# Altium schematic sheet Trottinette_Telemetrie_Circuit.SchDoc
size Tabloid; Date: Date; Author: Author 1; Revision: 1; SheetNumber: 3; SheetTotal: 4; Size: 11x17; Sheet_Name: Circuit
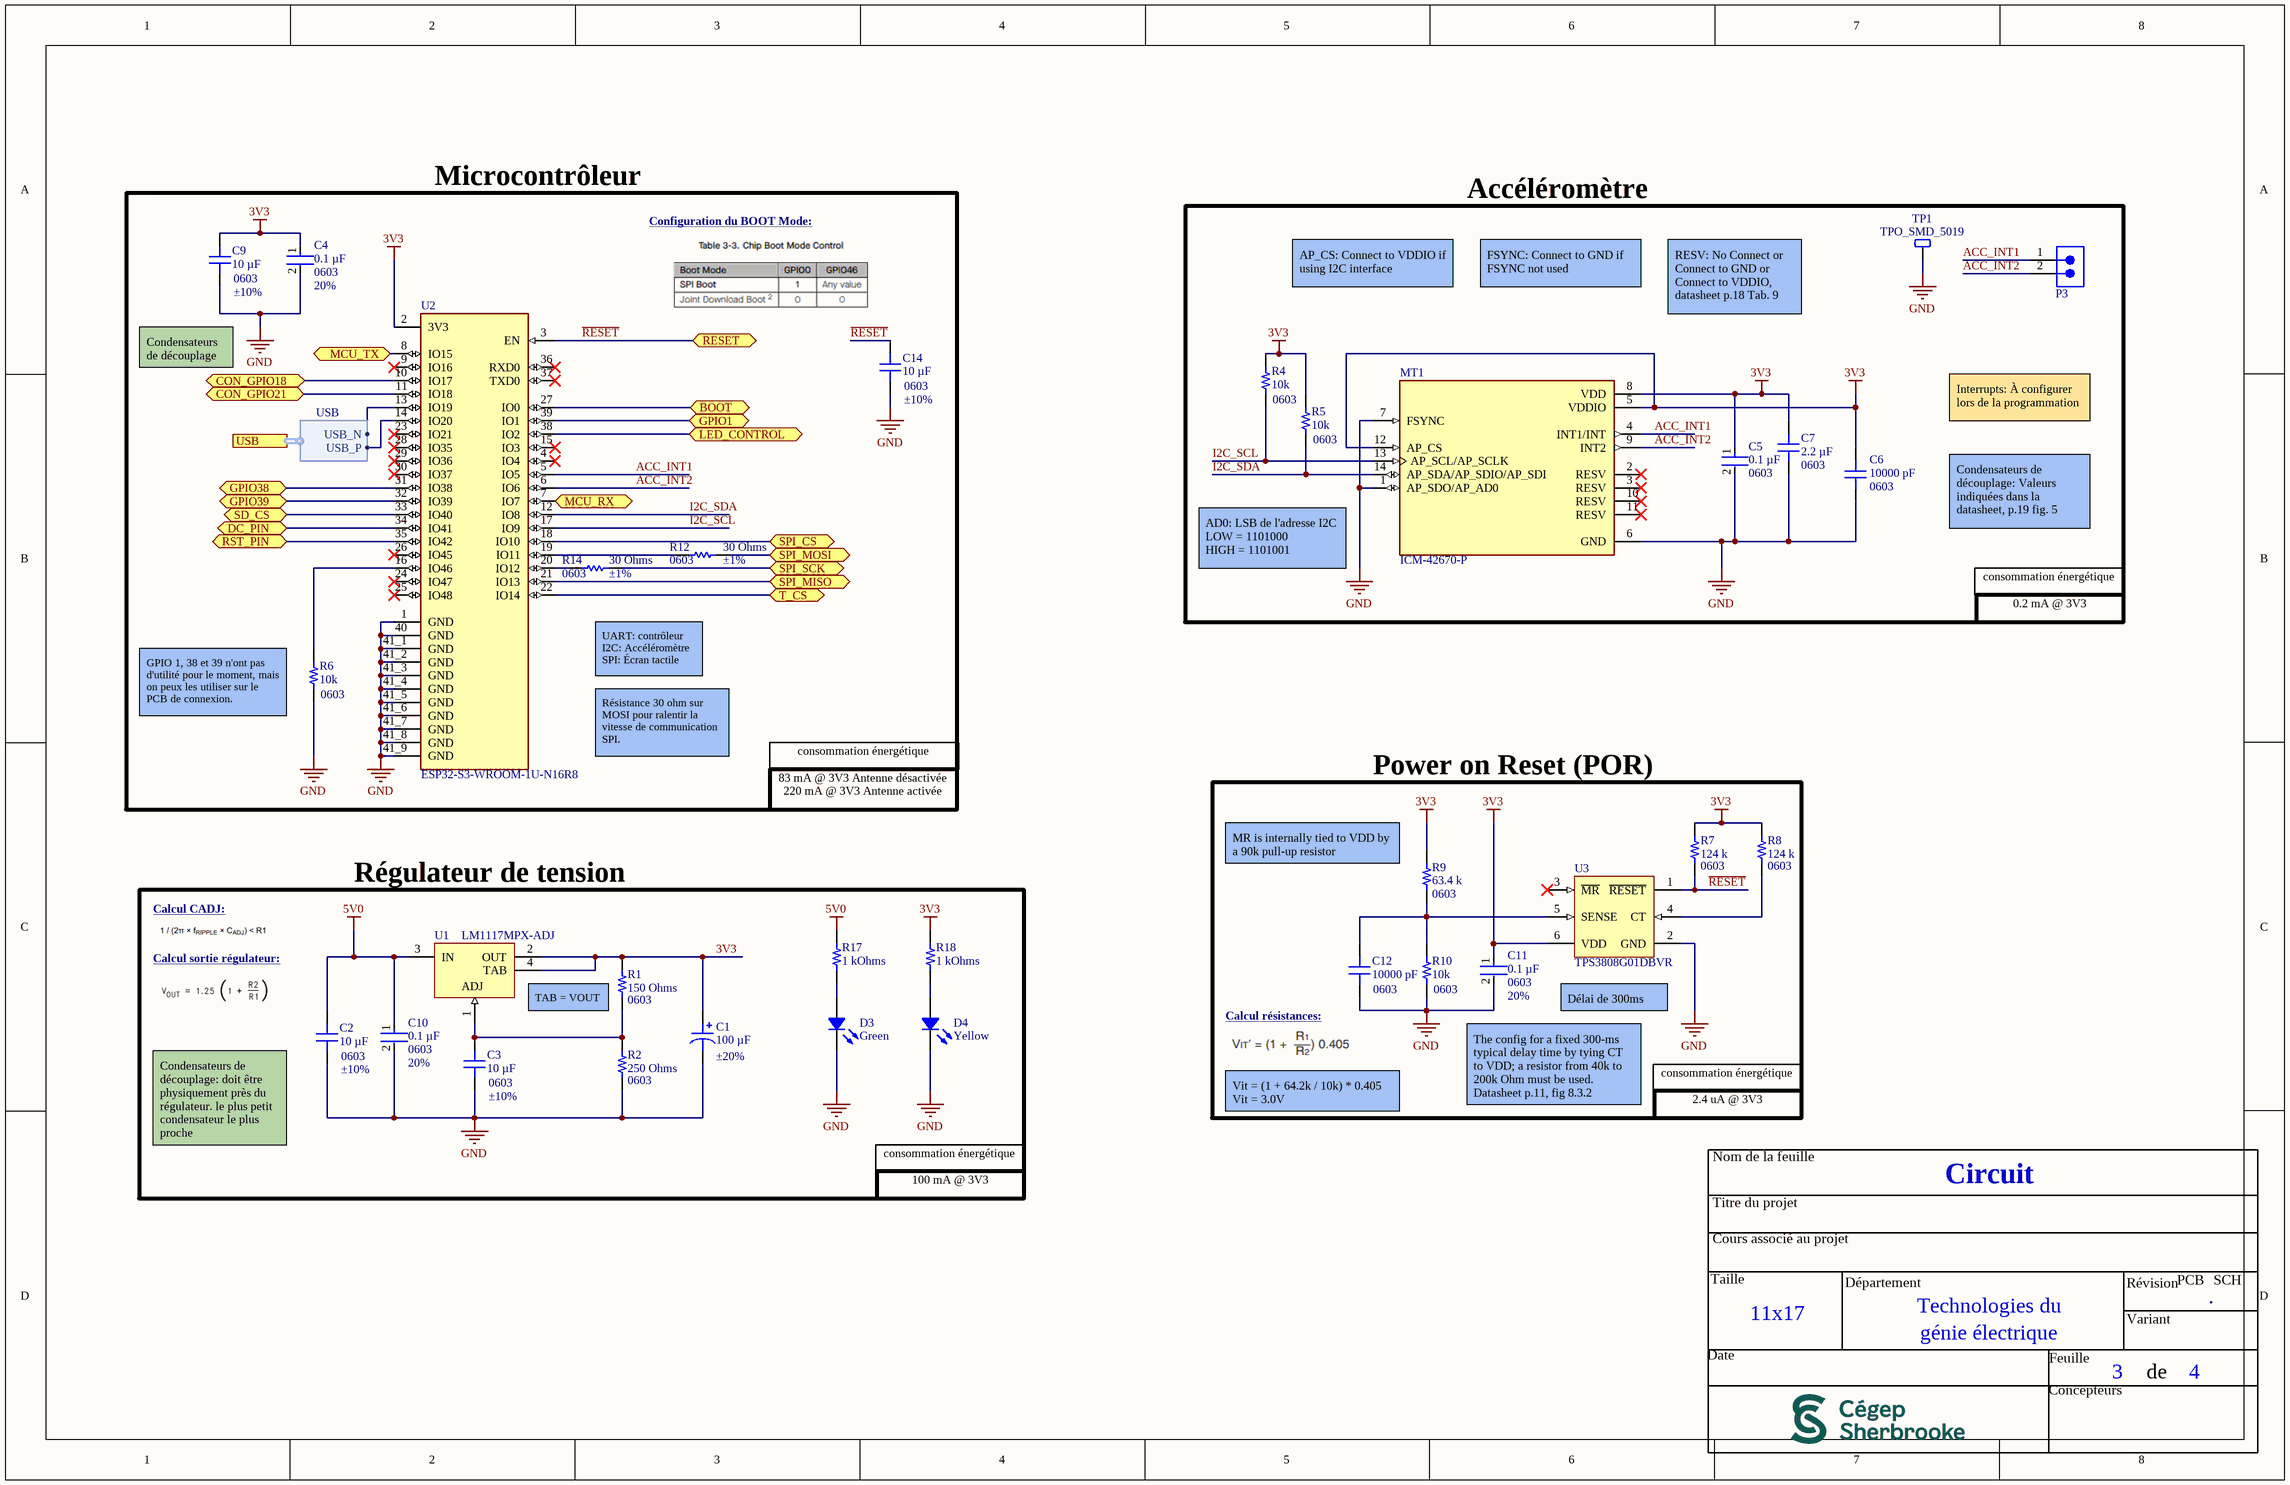
[diagram p0: Trottinette_Telemetrie_Circuit.SchDoc]

## Parts
C1  100 µF  Tolerance: ±20%  [CAP ALSMD 6.6MM H6.1MM]
C2  Device Package: 0603  Tolerance: ±10%  [CAP 0603_1608]  (hidden comment: 10 µF)
C3  Device Package: 0603  Tolerance: ±10%  [CAP 0603_1608]  (hidden comment: 10 µF)
C4  Case Code (Imperial): 0603  Tolerance: 20%  Capacitance: 0.1 µF  [FP-0603-L_1_6_0_15-W_0_81-IPC_B]  (hidden comment: 0603ZC104MAT2A)
C5  Case Code (Imperial): 0603  Capacitance: 0.1 µF  [FP-0603-L_1_6_0_15-W_0_81-IPC_B]  (hidden comment: 0603ZC104MAT2A)
C6  Package / Case: 0603  [CAP 0603_1608]  (hidden comment: 10000 pF)
C7  Package / Case: 0603  [CAP 0603_1608]  (hidden comment: 2.2 µF)
C9  Device Package: 0603  Tolerance: ±10%  [CAP 0603_1608]  (hidden comment: 10 µF)
C10  Case Code (Imperial): 0603  Tolerance: 20%  Capacitance: 0.1 µF  [FP-0603-L_1_6_0_15-W_0_81-IPC_B]  (hidden comment: 0603ZC104MAT2A)
C11  Case Code (Imperial): 0603  Tolerance: 20%  Capacitance: 0.1 µF  [FP-0603-L_1_6_0_15-W_0_81-IPC_B]  (hidden comment: 0603ZC104MAT2A)
C12  Device Package: 0603  [CAP 0603_1608]  (hidden comment: 10000 pF)
C14  Device Package: 0603  Tolerance: ±10%  [CAP 0603_1608]  (hidden comment: 10 µF)
D3  Green  [LED 0603_1608 GREEN]
D4  Yellow  [LED 0603_1608 YELLOW]
MT1  ICM-42670-P  [XDCR_ICM-42670-P]
P3  61300211121  [61300211121]  (value not drawn)
R1  Supplier Device Package: 0603  [RES 0603_1608]  (hidden comment: 150 Ohms)
R2  Supplier Device Package: 0603  [RES 0603_1608]  (hidden comment: 250 Ohms)
R4  Supplier Device Package: 0603  [RES 0603_1608]  (hidden comment: 10k)
R5  Supplier Device Package: 0603  [RES 0603_1608]  (hidden comment: 10k)
R6  Supplier Device Package: 0603  [RES 0603_1608]  (hidden comment: 10k)
R7  Supplier Device Package: 0603  [RES 0603_1608]  (hidden comment: 124 k)
R8  Supplier Device Package: 0603  [RES 0603_1608]  (hidden comment: 124 k)
R9  Supplier Device Package: 0603  [RES 0603_1608]  (hidden comment: 63.4 k)
R10  Supplier Device Package: 0603  [RES 0603_1608]  (hidden comment: 10k)
R12  ERJ3EKF30R0V  [RESC1608X55X30LL15T15]  (value not drawn)
R14  ERJ3EKF30R0V  [RESC1608X55X30LL15T15]  (value not drawn)
R17  1 kOhms  [RES 0603_1608]
R18  1 kOhms  [RES 0603_1608]
TP1  TPO_SMD_5019  [TPO_SMD_5019]
U1  LM1117MPX-ADJ  [MP04A_N]
U2  ESP32-S3-WROOM-1U-N16R8  [XCVR_ESP32-S3-WROOM-1U-N16R8]
U3  TPS3808G01DBVR  [DBV0006A_L]

## Blocks framed on the sheet
Microcontrôleur: C4 C9 C14 R6 R12 R14 U2
Accéléromètre: C5-C7 MT1 P3 R4 R5 TP1
Power on Reset (POR): C11 C12 R7-R10 U3
Régulateur de tension: C1-C3 C10 D3 D4 R1 R2 R17 R18 U1

## Ports
BOOT (bidir), CON_GPIO18 (bidir), CON_GPIO21 (bidir), DC_PIN (bidir), GPIO1 (bidir), GPIO38 (bidir), GPIO39 (bidir), LED_CONTROL (bidir), MCU_RX (bidir), MCU_TX (bidir), RESET (bidir), RST_PIN (bidir), SD_CS (bidir), SPI_CS (bidir), SPI_MISO (bidir), SPI_MOSI (bidir), SPI_SCK (bidir), T_CS (bidir), USB (harness USB)

## Harnesses
USB: USB_N, USB_P

## Nets
3V3: C1.1 C4.1 C5.1 C6.2 C7.2 C9.2 C11.1 MT1.5(VDDIO) MT1.8(VDD) MT1.12(AP_CS) R1.2 R4.2 R5.2 R7.2 R8.2 R9.2 R18.1 U1.2(OUT) U1.4(TAB) U2.2(3V3) U3.6(VDD)
5V0: C2.2 C10.1 R17.1 U1.3(IN)
GND: C1.2 C2.1 C3.1 C4.2 C5.2 C6.1 C7.1 C9.1 C10.2 C11.2 C12.1 C14.1 D3.2 D4.2 MT1.1(AP_SDO/AP_AD0) MT1.6(GND) MT1.7(FSYNC) R2.1 R6.1 R10.1 TP1.1 U2.1(GND) U2.40(GND) U2.41_1(GND) U2.41_2(GND) U2.41_3(GND) U2.41_4(GND) U2.41_5(GND) U2.41_6(GND) U2.41_7(GND) U2.41_8(GND) U2.41_9(GND) U3.2(GND)
~{RESET}: C14.2 R7.1 U2.3(EN) U3.1(~{RESET}) ; port RESET
ACC_INT1: MT1.4(INT1/INT) P3.1 U2.5(IO5)
ACC_INT2: MT1.9(INT2) P3.2 U2.6(IO6)
BOOT: U2.27(IO0) ; port BOOT
CON_GPIO18: U2.10(IO17) ; port CON_GPIO18
CON_GPIO21: U2.11(IO18) ; port CON_GPIO21
DC_PIN: U2.34(IO41) ; port DC_PIN
GPIO1: U2.39(IO1) ; port GPIO1
GPIO38: U2.31(IO38) ; port GPIO38
GPIO39: U2.32(IO39) ; port GPIO39
I2C_SCL: MT1.13(AP_SCL/AP_SCLK) R4.1 U2.17(IO9)
I2C_SDA: MT1.14(AP_SDA/AP_SDIO/AP_SDI) R5.1 U2.12(IO8)
LED_CONTROL: U2.38(IO2) ; port LED_CONTROL
MCU_RX: U2.7(IO7) ; port MCU_RX
MCU_TX: U2.8(IO15) ; port MCU_TX
RST_PIN: U2.35(IO42) ; port RST_PIN
SD_CS: U2.33(IO40) ; port SD_CS
SPI_CS: U2.18(IO10) ; port SPI_CS
SPI_MISO: U2.21(IO13) ; port SPI_MISO
SPI_MOSI: R12.2 ; port SPI_MOSI
SPI_SCK: R14.2 ; port SPI_SCK
T_CS: U2.22(IO14) ; port T_CS
NetC3_2: C3.2 R1.1 R2.2 U1.1(ADJ)
NetC12_2: C12.2 R9.1 R10.2 U3.5(SENSE)
NetD3_1: D3.1 R17.2
NetD4_1: D4.1 R18.2
NetR6_2: R6.2 U2.16(IO46)
NetR8_1: R8.1 U3.4(CT)
NetR12_1: R12.1 U2.19(IO11)
NetR14_1: R14.1 U2.20(IO12)
NetU2_13: U2.13(IO19) ; port USB.USB_N
NetU2_14: U2.14(IO20) ; port USB.USB_P

Not connected (* = marked no-connect by the designer): MT1 2(RESV)* 3(RESV)* 10(RESV)* 11(RESV)*; U2 4(IO4)* 9(IO16)* 15(IO3)* 23(IO21)* 24(IO47)* 25(IO48)* 26(IO45)* 28(IO35)* 29(IO36)* 30(IO37)* 36(RXD0)* 37(TXD0)*; U3 3(~{MR})*

## Notes on the sheet
- Configuration du BOOT Mode:
- AP_CS: Connect to VDDIO if using I2C interface
- FSYNC: Connect to GND if FSYNC not used
- Condensateurs de découplage
- RESV: No Connect or Connect to GND or Connect to VDDIO, datasheet p.18 Tab. 9
- Interrupts: À configurer lors de la programmation
- (near R14) 30 Ohms
- (near R12) 0603
- (near R12) 30 Ohms
- (near R12) ±1%
- AD0: LSB de l'adresse I2C LOW = 1101000
  HIGH = 1101001
- Condensateurs de découplage: Valeurs indiquées dans la datasheet, p.19 fig. 5
- (near R14) 0603
- (near R14) ±1%
- consommation énergétique
- 0.2 mA @ 3V3
- UART: contrôleur I2C: Accéléromètre SPI: Écran tactile
- (near R6) GPIO 1, 38 et 39 n'ont pas d'utilité pour le moment, mais on peux les utiliser sur le PCB de connexion.
- Résistance 30 ohm sur MOSI pour ralentir la vitesse de communication SPI.
- 83 mA @ 3V3 Antenne désactivée 220 mA @ 3V3 Antenne activée
- (near R9) MR is internally tied to VDD by a 90k pull-up resistor
- Calcul sortie régulateur:
- Calcul CADJ:
- TAB = VOUT
- (near C12) Calcul résistances:
- (near U3) Délai de 300ms
- Vit = (1 + 64.2k / 10k) * 0.405 Vit = 3.0V
- The config for a fixed 300-ms typical delay time by tying CT to VDD; a resistor from 40k to 200k Ohm must be used. Datasheet p.11, fig 8.3.2
- (near C2) Condensateurs de découplage: doit être physiquement près du régulateur. le plus petit condensateur le plus proche
- 2.4 uA @ 3V3
- 100 mA @ 3V3
- Nom de la feuille
- Titre du projet
- Cours associé au projet
- Taille
- Département
- Technologies du
- Révision
- PCB
- .
- SCH
- Date
- génie électrique
- Feuille
- Variant
- de
- Concepteurs

## Library data of the parts
C1 = 10SGV100M6.3X6.1: CAP ALUM 100UF 20% 10V SMD; manufacturer: Rubycon; Lifetime @ Temp.: 2000 Hrs @ 105°C; Polarization: Polar; Ripple Current @ High Frequency: 85.2 mA @ 10 kHz; Ripple Current @ Low Frequency: 71 mA @ 120 Hz; Surface Mount Land Size: 0.260" L x 0.260" W (6.60mm x 6.60mm); Part Number: 10SGV100M6.3X6.1; Applications: Automotive; Capacitance: 100 µF; componentlink1description: Datasheet; componentlink1url: http://www.rubycon.co.jp/en/catalog/e_pdfs/aluminum/e_sgv.pdf; componentlink2description: DigiKey Link; componentlink2url: https://www.digikey.com/en/products/detail/rubycon/10SGV100M6-3X6-1/3568604; Device Package: Radial, Can - SMD; Height - Seated (Max): 0.240" (6.10mm); lastupdated: 6/3/2024 8:16:10 PM; Lifecycle Status: Active; Minimum Order: 1; Mounting Type: Surface Mount; Operating Temperature: -55°C ~ 105°C; Package / Case: Radial, Can - SMD; packaging: TapeAndReel; partid: 8082; Part Status: Active; price: 0.08; Ratings: AEC-Q200; series: SGV; Size / Dimension: 0.248" Dia (6.30mm); Supplier 1: DigiKey; Supplier Part Number 1: 1189-2392-1-ND; value: 100 µF; Voltage - Rated: 10 V
C2 C3 C9 C14 = GRT188R61A106KE13D: CAP CER 10UF 10V X5R 0603; manufacturer: Murata Electronics; Part Number: GRT188R61A106KE13D; Value: 10 µF; Applications: Automotive; Capacitance: 10 µF; componentlink1description: Datasheet; componentlink1url: https://search.murata.co.jp/Ceramy/image/img/A01X/G101/ENG/GRT188R61A106KE13-01.pdf; componentlink2description: DigiKey Link; componentlink2url: https://www.digikey.com/en/products/detail/murata-electronics/GRT188R61A106KE13D/5416733; Features: Derating Recommended; lastupdated: 2/9/2024 8:10:30 PM; Lifecycle Status: Active; Minimum Order: 1; Mounting Type: Surface Mount, MLCC; Operating Temperature: -55°C ~ 85°C; Package / Case: 0603 (1608 Metric); packaging: TapeAndReel; partid: 2522; Part Status: Active; price: 0.06; Ratings: AEC-Q200; series: GRT; Size / Dimension: 0.063" L x 0.031" W (1.60mm x 0.80mm); Supplier 1: DigiKey; Supplier Part Number 1: 490-12311-1-ND; Temperature Coefficient: X5R; Thickness (Max): 0.037" (0.95mm); Voltage - Rated: 10V
C4 C5 C10 C11 = CMP-2006-04550-2: General Purpose Ceramic Capacitor, 0603, 100nF, 20%, X7R, 15%, 10V; Mount: Surface Mount; Package Quantity: 4000; RoHS Compliant: Yes; Voltage Rating: 10V; Packaging: Tape and Reel; Series: -; Thickness: 0.035inch; Number of Pins: 2; Min Operating Temperature: -55°C; Case/Package: 0603; Length: 1.6mm; Radiation Hardening: No; Voltage Rating (DC): 10V; Depth: 0.81mm; Lead Pitch: 0.014inch; Termination: SMD/SMT; Case Code (Metric): 1608; Construction: Flat; Width: 0.032inch; Lead Free: Lead Free; Max Operating Temperature: 125°C; Dielectric: X7R
  C5: Tolerance: 20%
C6 = C0603C103K4RECAUTO: CAP CER 0603 10NF 16V X7R 10%; manufacturer: KEMET; Part Number: C0603C103K4RECAUTO; Value: 10000 pF; Applications: Automotive, ESD Protection; Capacitance: 10000 pF; componentlink1description: Datasheet; componentlink1url: https://api.kemet.com/component-edge/download/datasheet/C0603C103K4RECAUTO.pdf; componentlink2description: DigiKey Link; componentlink2url: https://www.digikey.com/en/products/detail/kemet/C0603C103K4RECAUTO/8640474; Device Package: 0603 (1608 Metric); lastupdated: 2/9/2024 8:10:22 PM; Lifecycle Status: Active; Minimum Order: 1; Mounting Type: Surface Mount, MLCC; Operating Temperature: -55°C ~ 125°C; packaging: TapeAndReel; partid: 8251; Part Status: Active; price: 0.01; Ratings: AEC-Q200; series: ESD SMD Auto X7R; Size / Dimension: 0.063" L x 0.031" W (1.60mm x 0.80mm); Supplier 1: DigiKey; Supplier Part Number 1: 399-17880-1-ND; Temperature Coefficient: X7R; Thickness (Max): 0.034" (0.87mm); Tolerance: ±10%; Voltage - Rated: 16V
C7 = CC0603ZRY5V7BB225: CAP CER 2.2UF 16V Y5V 0603; manufacturer: Yageo; Temperature Coefficient: Y5V (F); Tolerance: -20%, +80%; Part Number: CC0603ZRY5V7BB225; Value: 2.2 µF; Applications: General Purpose; Capacitance: 2.2 µF; componentlink1description: Datasheet; componentlink1url: http://www.yageo.com/documents/recent/UPY-GPHC_Y5V_6.3V-to-50V_8.pdf; componentlink2description: DigiKey Link; componentlink2url: https://www.digikey.com/en/products/detail/yageo/CC0603ZRY5V7BB225/5883851; Device Package: 0603 (1608 Metric); lastupdated: 2/9/2024 8:10:30 PM; Lifecycle Status: Active; Minimum Order: 1; Mounting Type: Surface Mount, MLCC; Operating Temperature: -30°C ~ 85°C; packaging: TapeAndReel; partid: 2203; Part Status: Active; price: 0.01; series: CC; Size / Dimension: 0.063" L x 0.031" W (1.60mm x 0.80mm); Supplier 1: DigiKey; Supplier Part Number 1: 311-3416-1-ND; Thickness (Max): 0.035" (0.90mm); Voltage - Rated: 16V
C12 = AC0603KRX7R0BB103: CAP CER 10000PF 100V X7R 0603; manufacturer: Yageo; Tolerance: ±10%; Part Number: AC0603KRX7R0BB103; Value: 10000 pF; Applications: Automotive; Capacitance: 10000 pF; componentlink1description: Datasheet; componentlink1url: http://www.yageo.com/NewPortal/_en/search/productDocs.jsp?YageoPartNumber=AC0603KRX7R0BB103; componentlink2description: DigiKey Link; componentlink2url: https://www.digikey.com/en/products/detail/yageo/AC0603KRX7R0BB103/6643086; lastupdated: 2024-02-09 20:10:30; Lifecycle Status: Active; Minimum Order: 1; Mounting Type: Surface Mount, MLCC; Operating Temperature: -55°C ~ 125°C; Package / Case: 0603 (1608 Metric); packaging: TapeAndReel; partid: 2218; Part Status: Active; price: 0.01; Ratings: AEC-Q200; series: AC; Size / Dimension: 0.063" L x 0.031" W (1.60mm x 0.80mm); Supplier 1: DigiKey; Supplier Part Number 1: 311-3100-1-ND; Temperature Coefficient: X7R; Thickness (Max): 0.035" (0.90mm); Voltage - Rated: 100V
D3 = 5973316507F: LED GREEN 0603 SMD; Manufacturer: Dialight; Configuration: Standard; Current - Test: 20mA; Lens Color: 1.24mm; Lens Style: Round with Domed Top; Millicandela Rating: 34mcd; Voltage - Forward (Vf) (Typ): 2V; Wavelength - Dominant: 560nm; Part Number: 5973316507F; Color: Green; ComponentLink1Description: Datasheet; ComponentLink1URL: http://www.dialightsignalsandcomponents.com/Assets/Drawings/2D_Drawings_DrawingDetailedSpec/NewDrawings/C18371C.pdf; ComponentLink2Description: DigiKey Link; ComponentLink2URL: https://www.digikey.com/en/products/detail/dialight/5973316507F/9385428; Device Package: 0603 (1608 Metric); Height (Max): 1.24mm; LastUpdated: 6/3/2024 7:58:53 PM; Lifecycle Status: Active; Minimum Order: 1; Mounting Type: Surface Mount; Package / Case: 0603 (1608 Metric); Packaging: TapeAndReel; PartId: 587; Part Status: Active; Price: 0.13; Series: 597; Size / Dimension: 1.60mm L x 0.80mm W; Supplier 1: DigiKey; Supplier Part Number 1: 350-4373-1-ND; Supplier Device Package: 0603; Value: Green
D4 = 5990040007F: LED YELLOW 0603 SMD; Manufacturer: Dialight; Configuration: Standard; Current - Test: 20mA; Lens Color: 0.80mm; Lens Size: 1.10mm x 0.80mm; Lens Style: Rectangle with Flat Top; Millicandela Rating: 105mcd; Viewing Angle: 140°; Voltage - Forward (Vf) (Typ): 2.1V; Wavelength - Dominant: 590nm; Part Number: 5990040007F; Color: Yellow; ComponentLink1Description: Datasheet; ComponentLink1URL: http://www.dialightsignalsandcomponents.com/Assets/Brochures_And_Catalogs/Indication/CBI_SMD_new/Dialight_CBI_data_599-0603_Apr2018.pdf; ComponentLink2Description: DigiKey Link; ComponentLink2URL: https://www.digikey.com/en/products/detail/dialight/5990040007F/9385404; Device Package: 0603 (1608 Metric); Height (Max): 0.80mm; LastUpdated: 6/3/2024 8:01:10 PM; Lifecycle Status: Active; Minimum Order: 1; Mounting Type: Surface Mount; Package / Case: 0603 (1608 Metric); Packaging: TapeAndReel; PartId: 83; Part Status: Active; Price: 0.04; Series: 599; Size / Dimension: 1.60mm L x 0.80mm W; Supplier 1: DigiKey; Supplier Part Number 1: 350-4349-1-ND; Supplier Device Package: 0603; Value: Yellow
P3 = 61300211121: WR-PHD Pin Header, THT, Vertical, pitch 2.54mm, 1 Row, 2P; Manufacturer: Wurth Elektronik; Contact Resistance: 20mOhm; Rated Current: 3A; Working Voltage: 250V; Withstanding Voltage: 500V; Manufacturer Part Number: 61300211121; Category: Board-to-Board Connectors; Match Code: WR-PHD; ComponentLink1Description: Website Link; ComponentLink1URL: https://www.we-online.com/redexpert/article/61300211121?ad; ComponentLink2Description: Datasheet Link; ComponentLink2URL: https://www.we-online.com/redexpert/spec/61300211121?ad; Mount: Through Hole; Operating Temperature Max: 105°C; Operating Temperature Min: -40°C; Packaging: Bag; Gender: Pin Header; Number of Pins: 2; Number of Rows: 1; Orientation: Vertical; Pitch: 2.54mm
R1 = RMCF0603FT150R: RES 150 OHM 1% 1/10W 0603; Manufacturer: Stackpole Electronics Inc; Power (Watts): 0.1W, 1/10W; Temperature Coefficient: ±100ppm/°C; Part Number: RMCF0603FT150R; Value: 150 Ohms; ComponentLink1Description: Datasheet; ComponentLink1URL: https://www.seielect.com/catalog/sei-rmcf_rmcp.pdf; ComponentLink2Description: DigiKey Link; ComponentLink2URL: https://www.digikey.com/en/products/detail/stackpole-electronics-inc/RMCF0603FT150R/1761314; Composition: Thick Film; Device Package: 0603 (1608 Metric); Features: Automotive AEC-Q200; Height - Seated (Max): 0.022" (0.55mm); LastUpdated: 2/9/2024 8:43:14 PM; Lifecycle Status: Active; Minimum Order: 1; Number of Terminations: 2; Operating Temperature: -55°C ~ 155°C; Package / Case: 0603 (1608 Metric); Packaging: CutTape; PartId: 10675; Part Status: Active; Price: 0.01; Ratings: AEC-Q200; Resistance: 150 Ohms; Series: RMCF; Size / Dimension: 0.061" L x 0.031" W (1.55mm x 0.80mm); Supplier 1: DigiKey; Supplier Part Number 1: RMCF0603FT150RCT-ND; Tolerance: ±1%
R2 = CH0603-250RJNTA: RES 250 OHM 5% 1/8W 0603; Manufacturer: Vishay Sfernice; Power (Watts): 0.125W, 1/8W; Temperature Coefficient: ±100ppm/°C; Part Number: CH0603-250RJNTA; Value: 250 Ohms; ComponentLink1Description: Datasheet; ComponentLink1URL: http://www.vishay.com/docs/53014/ch.pdf; ComponentLink2Description: DigiKey Link; ComponentLink2URL: https://www.digikey.com/en/products/detail/vishay-sfernice/CH0603-250RJNTA/9405751; Composition: Thin Film; Device Package: 0603 (1608 Metric); Features: RF, High Frequency; Height - Seated (Max): 0.025" (0.63mm); LastUpdated: 2/9/2024 8:43:16 PM; Lifecycle Status: Active; Minimum Order: 1; Number of Terminations: 2; Operating Temperature: -55°C ~ 155°C; Package / Case: 0603 (1608 Metric); Packaging: TapeAndReel; PartId: 10119; Part Status: Active; Price: 2.39; Resistance: 250 Ohms; Series: CH; Size / Dimension: 0.060" L x 0.030" W (1.52mm x 0.76mm); Supplier 1: DigiKey; Supplier Part Number 1: 716-1168-1-ND; Tolerance: ±5%
R4-R6 R10 = RNCS0603BKE10K0: RES 10K OHM 0.1% 1/16W 0603; Manufacturer: Stackpole Electronics Inc; Power (Watts): 0.063W, 1/16W; Resistance: 10 kOhms; Temperature Coefficient: ±25ppm/°C; Part Number: RNCS0603BKE10K0; Value: 10k; ComponentLink1Description: Datasheet; ComponentLink1URL: https://www.seielect.com/catalog/sei-rncs_rnch.pdf; ComponentLink2Description: DigiKey Link; ComponentLink2URL: https://www.digikey.com/en/products/detail/stackpole-electronics-inc/RNCS0603BKE10K0/1708836; Composition: Thin Film; Device Package: 0603 (1608 Metric); Features: Anti-Corrosive, Automotive AEC-Q200, Moisture Resistant; Height - Seated (Max): 0.022" (0.55mm); LastUpdated: 2/9/2024 8:43:37 PM; Lifecycle Status: Active; Minimum Order: 1; Number of Terminations: 2; Operating Temperature: -55°C ~ 155°C; Package / Case: 0603 (1608 Metric); Packaging: TapeAndReel; PartId: 4838; Part Status: Active; Price: 0.06; Ratings: AEC-Q200; Series: RNCS; Size / Dimension: 0.061" L x 0.031" W (1.55mm x 0.80mm); Supplier 1: DigiKey; Supplier Part Number 1: RNCS0603BKE10K0CT-ND; Tolerance: ±0.1%
R7 R8 = RMCF0603FT124K: RES 124K OHM 1% 1/10W 0603; Manufacturer: Stackpole Electronics Inc; Power (Watts): 0.1W, 1/10W; Resistance: 124 kOhms; Temperature Coefficient: ±100ppm/°C; Part Number: RMCF0603FT124K; Value: 124 k; ComponentLink1Description: Datasheet; ComponentLink1URL: https://www.seielect.com/catalog/sei-rmcf_rmcp.pdf; ComponentLink2Description: DigiKey Link; ComponentLink2URL: https://www.digikey.com/en/products/detail/stackpole-electronics-inc/RMCF0603FT124K/1761224; Composition: Thick Film; Device Package: 0603 (1608 Metric); Features: Automotive AEC-Q200; Height - Seated (Max): 0.022" (0.55mm); LastUpdated: 2/9/2024 8:43:13 PM; Lifecycle Status: Active; Minimum Order: 1; Number of Terminations: 2; Operating Temperature: -55°C ~ 155°C; Package / Case: 0603 (1608 Metric); Packaging: CutTape; PartId: 10853; Part Status: Active; Price: 0.01; Ratings: AEC-Q200; Series: RMCF; Size / Dimension: 0.061" L x 0.031" W (1.55mm x 0.80mm); Supplier 1: DigiKey; Supplier Part Number 1: RMCF0603FT124KCT-ND; Tolerance: ±1%
R9 = RMCF0603FT63K4: RES 63.4K OHM 1% 1/10W 0603; Manufacturer: Stackpole Electronics Inc; Power (Watts): 0.1W, 1/10W; Resistance: 63.4 kOhms; Temperature Coefficient: ±100ppm/°C; Part Number: RMCF0603FT63K4; Value: 63.4 k; ComponentLink1Description: Datasheet; ComponentLink1URL: https://www.seielect.com/catalog/sei-rmcf_rmcp.pdf; ComponentLink2Description: DigiKey Link; ComponentLink2URL: https://www.digikey.com/en/products/detail/stackpole-electronics-inc/RMCF0603FT63K4/1714177; Composition: Thick Film; Device Package: 0603 (1608 Metric); Features: Automotive AEC-Q200; Height - Seated (Max): 0.022" (0.55mm); LastUpdated: 2/9/2024 8:43:20 PM; Lifecycle Status: Active; Minimum Order: 1; Number of Terminations: 2; Operating Temperature: -55°C ~ 155°C; Package / Case: 0603 (1608 Metric); Packaging: CutTape; PartId: 8895; Part Status: Active; Price: 0.01; Ratings: AEC-Q200; Series: RMCF; Size / Dimension: 0.061" L x 0.031" W (1.55mm x 0.80mm); Supplier 1: DigiKey; Supplier Part Number 1: RMCF0603FT63K4CT-ND; Tolerance: ±1%
R12 R14 = CMP-2000-00423-1: Manufacturer: Panasonic; Part Number: ERJ3EKF30R0V
R17 R18 = CPF0603B1K0E: RES SMD 1K OHM 0.1% 1/16W 0603; Manufacturer: TE Connectivity Passive Product; Power (Watts): 0.063W, 1/16W; Temperature Coefficient: ±25ppm/°C; Part Number: CPF0603B1K0E; Value: 1 kOhms; ComponentLink1Description: Datasheet; ComponentLink1URL: https://www.te.com/commerce/DocumentDelivery/DDEController?Action=srchrtrv&DocNm=1773200&DocType=DS&DocLang=English; ComponentLink2Description: DigiKey Link; ComponentLink2URL: https://www.digikey.com/en/products/detail/te-connectivity-passive-product/CPF0603B1K0E/2390473; Composition: Thin Film; Device Package: 0603 (1608 Metric); Height - Seated (Max): 0.022" (0.55mm); LastUpdated: 2/9/2024 8:43:37 PM; Lifecycle Status: Active; Minimum Order: 1; Number of Terminations: 2; Operating Temperature: -55°C ~ 155°C; Package / Case: 0603 (1608 Metric); Packaging: TapeAndReel; PartId: 4877; Part Status: Active; Price: 0.09; Resistance: 1 kOhms; Series: CPF, Neohm; Size / Dimension: 0.061" L x 0.031" W (1.55mm x 0.80mm); Supplier 1: DigiKey; Supplier Part Number 1: A119887CT-ND; Supplier Device Package: 0603; Tolerance: ±0.1%
TP1 = CMP-007-000000-1: TPO - PC TEST POINT MINI - SMD; Manufacturer #1: Keystone Electronics; Part Number #1: 5019; Value: 3.81mm x 2.03mm; Polarized: No; Power Max: *; Source: CEGEP_SHERBROOKE_TGE_LIBRARY.SchLib; Note: *; HelpURL: https://www.digikey.ca/product-detail/en/keystone-electronics/5019/36-5019CT-ND/3907344; Package: SMD; Component Type: Standard; Design Item ID: TPO_SMD_5019; Pin Count: 1; Assembly Type: SMD
U1 = CMP-0062-01642-3: 800mA Low-Dropout Linear Regulator, 4-pin SOT-223; Manufacturer: National Semiconductor; CompType: LDO IC; PowerWise: N; PackageTopMarking: XYTT*N03A; High-Reliability: Y; DatasheetVersion: Apr-2006; PackageReference: MP04A; Code_JEDEC: TO-261-AA; ComponentLink2URL: http://www.national.com/ds/LM/LM1117.pdf; ComponentLink3Description: LM1117 Web Page; ComponentLink4Description: MP04A Package Page; ComponentLink2Description: LM1117 Datasheet; PinCount: 4; Code_IPC: SOT223-4; PartNumber: LM1117MPX-ADJ; ComponentLink1Description: Manufacturer URL; ComponentLink3URL: http://www.national.com/pf/LM/LM1117.html; ComponentLink4URL: http://www.national.com/packaging/folders/mp04a.html; RoHS: N; PackageDescription: Molded SOT-223, 6.50 x 3.56 x 1.6mm Body, 4 Lead, 2.3mm Pitch; RevisionNote: SCH symbol layout adjusted; ComponentLink1URL: http://www.national.com/; PackageVersion: revB, Apr-2003
U2 = ESP32-S3-WROOM-1U-N16R8: Bluetooth, WiFi 802.11b/g/n, Bluetooth v5.0 Transceiver Module 2.4GHz Antenna Not Included, U.FL Surface Mount; MF: Espressif Systems; Package: None; Price: None; Value: *; SnapEDA_Link: https://www.snapeda.com/parts/ESP32-S3-WROOM-1U-N16R8/Espressif+Systems/view-part/?ref=snap; MP: ESP32-S3-WROOM-1U-N16R8; Availability: Unavailable; Check_prices: https://www.snapeda.com/parts/ESP32-S3-WROOM-1U-N16R8/Espressif+Systems/view-part/?ref=eda
U3 = CMP-0332-00558-2: Low Quiescent Current, Programmable-Delay Supervisory Circuit, 1 Supply Monitored, -40 to 125 degC, 6-pin SOT-23 (DBV), Green (RoHS & no Sb/Br); Manufacturer: Texas Instruments; Rating: Catalog; SubFamily: Supervisor and Reset IC; Iq(Typ)(uA): 2.4; Output Driver Type / Reset Output: Active-low, Open-drain; Threshold Voltage 1 (typ)(Typ)(V): Adjustable; VCC(Max)(V): 6.5; VCC(Min)(V): 1.7; Reset Threshold Accuracy(%): 1; Code_JEDEC: MO-178-AB*; Mounting Technology: Surface Mount; DatasheetVersion: SBVS050J; Time Delay(ms): Programmable; ComponentLink1URL: http://www.ti.com/general/docs/lit/getliterature.tsp?genericPartNumber=TPS3808G01&fileType=pdf; PartNumber: TPS3808G01DBVR; PackageVersion: revK, Mar-2006; PackageReference: DBV0006A; # of Supplies Monitored: 1; ComponentLink1Description: Datasheet; PackageDescription: 6-Pin Plastic Small-Outline Package, 2.9 x 1.6 mm Body, 0.95 mm Pitch, 2.8 mm Lead Span
MT1 = ICM-42670-P: Package: None; Price: None; Value: *; MP: ICM-42670-P; Availability: Unavailable